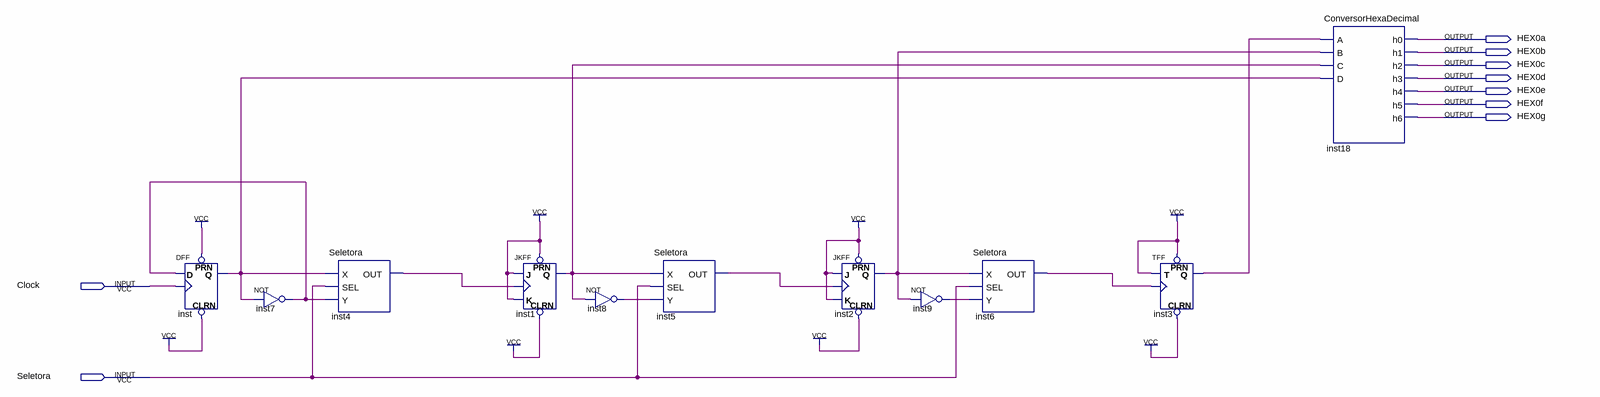
[diagram p0: schematic sheet]
// Quartus schematic Prova1.bdf as structural Verilog: 11 symbols, 9 pins
module Prova1 (
  input  Clock,
  input  Seletora,
  output HEX0a,
  output HEX0b,
  output HEX0c,
  output HEX0d,
  output HEX0e,
  output HEX0f,
  output HEX0g
);

  wire inst1_q, inst2_q, inst3_q, inst4_out, inst5_out, inst6_out, inst7_out, inst8_out, inst9_out, inst_q;

  DFF inst (.CLRN(1'b1), .CLK(Clock), .D(inst7_out), .PRN(1'b1), .Q(inst_q));
  not inst7 (inst7_out, inst_q);
  Seletora inst4 (.X(inst_q), .SEL(Seletora), .Y(inst7_out), .OUT(inst4_out));
  JKFF inst1 (.PRN(1'b1), .CLRN(1'b1), .K(1'b1), .J(1'b1), .CLK(inst4_out), .Q(inst1_q));
  not inst8 (inst8_out, inst1_q);
  Seletora inst5 (.X(inst1_q), .SEL(Seletora), .Y(inst8_out), .OUT(inst5_out));
  JKFF inst2 (.PRN(1'b1), .CLRN(1'b1), .K(1'b1), .J(1'b1), .CLK(inst5_out), .Q(inst2_q));
  not inst9 (inst9_out, inst2_q);
  Seletora inst6 (.X(inst2_q), .SEL(Seletora), .Y(inst9_out), .OUT(inst6_out));
  TFF inst3 (.PRN(1'b1), .CLRN(1'b1), .T(1'b1), .CLK(inst6_out), .Q(inst3_q));
  ConversorHexaDecimal inst18 (
    .A(inst3_q), .B(inst2_q), .C(inst1_q), .D(inst_q), .h0(HEX0a), .h1(HEX0b), .h2(HEX0c), .h3(HEX0d),
    .h4(HEX0e), .h5(HEX0f), .h6(HEX0g));
endmodule
